# EAGLE design Kapazitätsmessung mit rs232 (EAGLE 4.15)
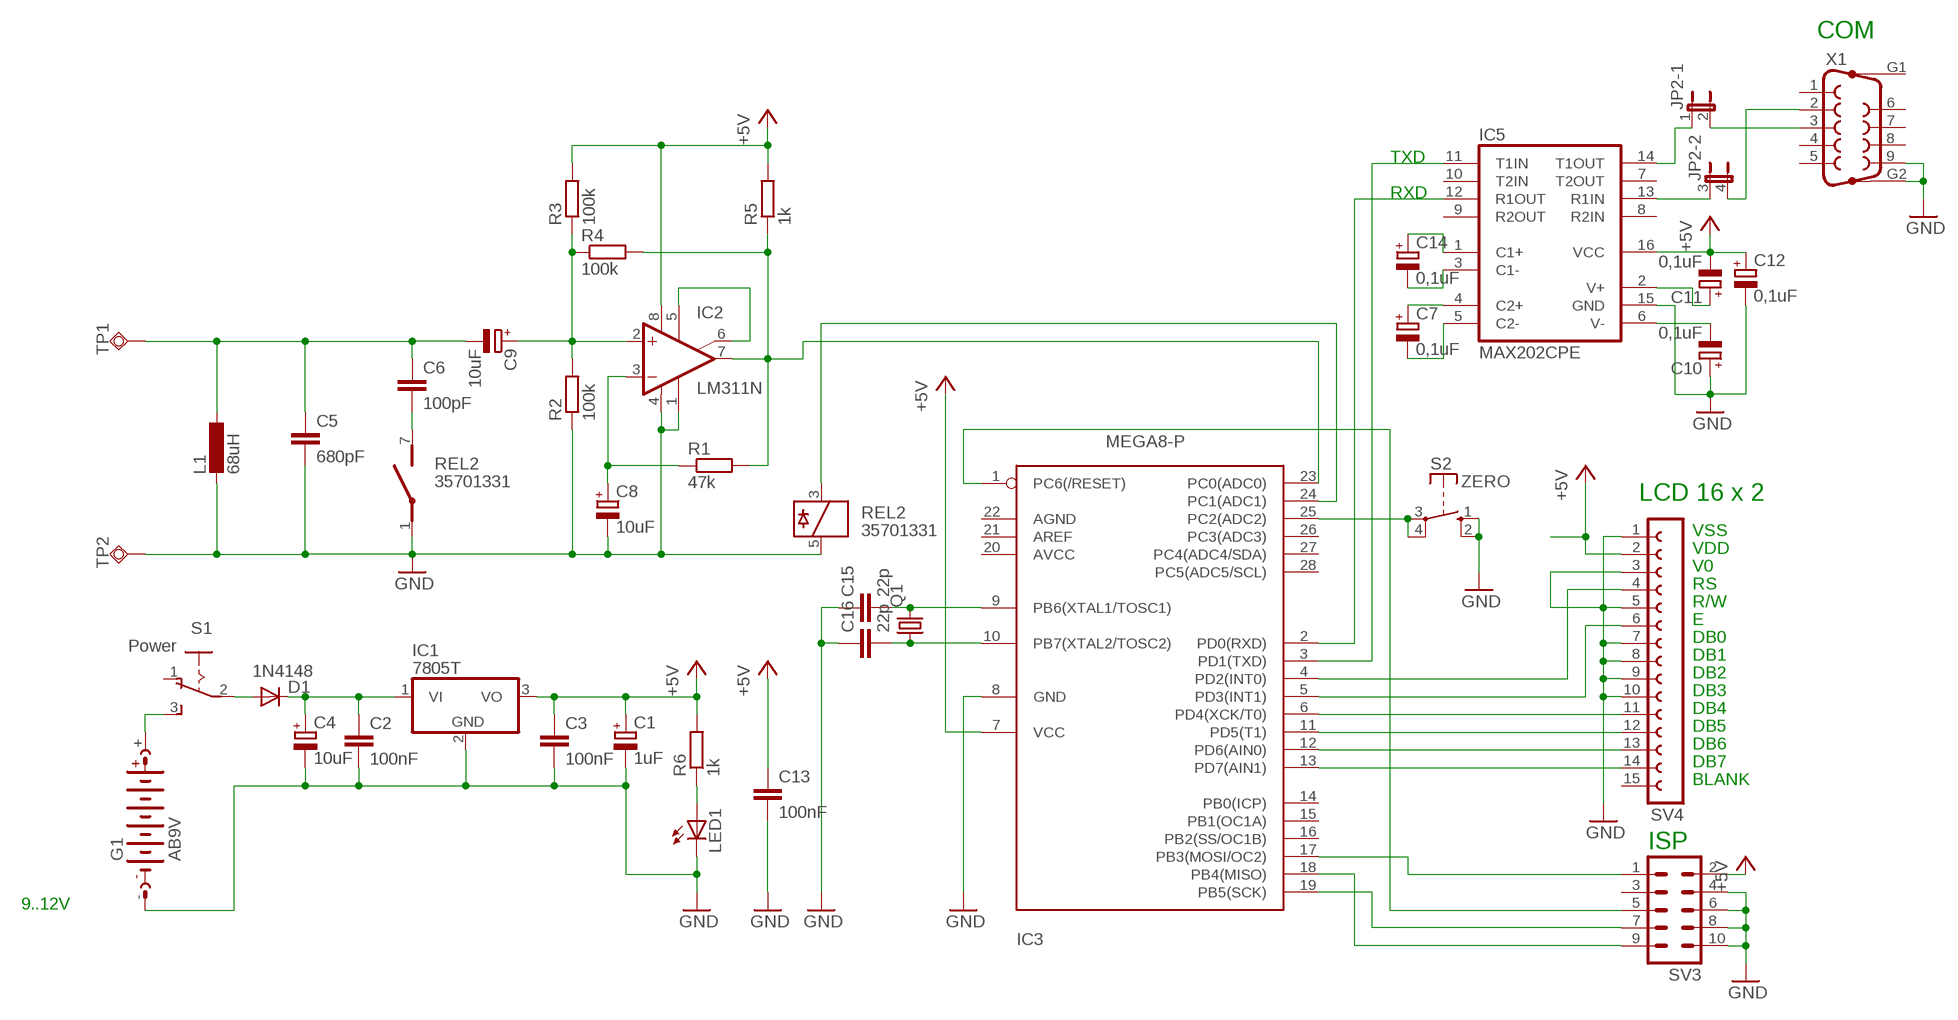
[diagram p0: schematic, sheet 1]

## Parts
C1  1uF  CPOL-EUE2.5-7  [E2,5-7]
C2  100nF  C-EU025-030X050  [C025-030X050]
C3  100nF  C-EU025-030X050  [C025-030X050]
C4  10uF  CPOL-EUE2.5-7  [E2,5-7]
C5  680pF  C-EU025-030X050  [C025-030X050]
C6  100pF  C-EU025-030X050  [C025-030X050]
C7  0,1uF  CPOL-EUE2.5-4V  [E2,5RE]
C8  10uF  CPOL-EUE2.5-5  [E2,5-5]
C9  10uF  CPOL-EUE2.5-5  [E2,5-5]
C10  0,1uF  CPOL-EUE2.5-4V  [E2,5RE]
C11  0,1uF  CPOL-EUE2.5-4V  [E2,5RE]
C12  0,1uF  CPOL-EUE2.5-4V  [E2,5RE]
C13  100nF  C-EU025-030X050  [C025-030X050]
C14  0,1uF  CPOL-EUE2.5-4V  [E2,5RE]
C15  22p  C-EU025-024X044  [C025-024X044]
C16  22p  C-EU025-024X044  [C025-024X044]
D1  1N4148  [DO35-10]
G1  AB9V  [AB9V]
IC1  7805T  [TO220H]
IC2  LM311N  [DIL08]
IC3  MEGA8-P  [DIL28-3]
IC5  MAX202CPE  [DIL16]
JP2  JP2QE  [JP2Q]
L1  68uH  L-EU0207/10  [0207/10]
LED1  LED3MM  [LED3MM]
Q1  CRYTALHC18U-V  [HC18U-V]
R1  47k  R-EU_0207/7  [0207/7]
R2  100k  R-EU_0207/7  [0207/7]
R3  100k  R-EU_0207/7  [0207/7]
R4  100k  R-EU_0207/7  [0207/7]
R5  1k  R-EU_0207/7  [0207/7]
R6  1k  R-EU_0207/7  [0207/7]
REL2  35701331  [REED]
S1  Power  255SB  [255SB]
S2  ZERO  DT6  [DT6]
SV3  ML10  [ML10]
SV4  FE15-1  [FE15]
TP1  TPSQPAD1-20Y  [P1-20Y]
TP2  TPSQPAD1-20Y  [P1-20Y]
X1  F09HP  [F09HP]

## Nets
+5V: C1.+ C3.1 C11.- C12.+ C13.1 IC1.3(VO) IC2.8(V+) IC3.7(VCC) IC5.16(VCC) R3.2 R5.2 R6.2 SV3.2 SV4.2
GND: C1.- C2.2 C3.2 C4.- C5.2 C8.- C10.+ C12.- C13.2 C15.1 C16.1 G1.- IC1.2(GND) IC2.1(GND) IC2.4(V-) IC3.8(GND) IC5.15(GND) L1.2 LED1.K(C) R2.1 REL2.1(2:P) REL2.5 S2.1(S) S2.2(S) SV3.4 SV3.6 SV3.8 SV3.10 SV4.1 SV4.3 SV4.5 SV4.7 SV4.8 SV4.9 SV4.10 TP2.1(TP) X1.9 X1.G2
N$1: D1.A S1.2(P)
N$2: C2.1 C4.+ D1.C IC1.1(VI)
N$3: G1.+ S1.3(S)
N$4: IC3.1(PC6(/RESET)) SV3.5
N$5: IC2.5(ON) IC2.6(ON/STR)
N$6: IC2.7(OUT) IC3.23(PC0(ADC0)) R1.2 R4.2 R5.1
N$7: C14.- IC5.3(C1-)
N$8: C8.+ IC2.3(-IN) R1.1
N$9: C6.2 REL2.7(2:S)
N$10: C9.+ IC2.2(+IN) R2.2 R3.1 R4.1
N$11: C5.1 C6.1 C9.- L1.1 TP1.1(TP)
N$12: C14.+ IC5.1(C1+)
N$13: LED1.A R6.1
N$14: IC3.19(PB5(SCK)) SV3.7
N$15: IC3.18(PB4(MISO)) SV3.9
N$16: IC5.14(T1OUT) JP2.1
N$17: JP2.4 X1.2
N$19: C7.+ IC5.4(C2+)
N$20: C7.- IC5.5(C2-)
N$21: IC5.13(R1IN) JP2.3
N$22: C15.2 IC3.9(PB6(XTAL1/TOSC1)) Q1.2
N$23: C16.2 IC3.10(PB7(XTAL2/TOSC2)) Q1.1
N$25: IC3.4(PD2(INT0)) SV4.4
N$26: IC3.5(PD3(INT1)) SV4.6
N$27: IC3.13(PD7(AIN1)) SV4.14
N$28: IC3.12(PD6(AIN0)) SV4.13
N$29: IC3.11(PD5(T1)) SV4.12
N$30: IC3.6(PD4(XCK/T0)) SV4.11
N$31: IC3.17(PB3(MOSI/OC2)) SV3.1
N$33: JP2.2 X1.3
N$34: IC3.24(PC1(ADC1)) REL2.3
N$35: IC3.25(PC2(ADC2)) S2.3(P) S2.4(P)
RXD: IC3.2(PD0(RXD)) IC5.12(R1OUT)
TXD: IC3.3(PD1(TXD)) IC5.11(T1IN)
V+: C11.+ IC5.2(V+)
V-: C10.- IC5.6(V-)
Unconnected: IC3.14(PB0(ICP)) IC3.15(PB1(OC1A)) IC3.16(PB2(SS/OC1B)) IC3.20(AVCC) IC3.21(AREF) IC3.22(AGND) IC3.26(PC3(ADC3)) IC3.27(PC4(ADC4/SDA)) IC3.28(PC5(ADC5/SCL)) IC5.7(T2OUT) IC5.8(R2IN) IC5.9(R2OUT) IC5.10(T2IN) S1.1(O) SV3.3 SV4.15 X1.1 X1.4 X1.5 X1.6 X1.7 X1.8 X1.G1

## Notes on the sheet
- COM
- TXD
- RXD
- LCD 16 x 2
- VSS
- VDD
- V0
- RS
- R/W
- E
- DB0
- DB1
- DB2
- DB3
- DB4
- DB5
- DB6
- DB7
- BLANK
- ISP
- 9..12V

## Library data of the parts
C1 C4 C7-C12 C14 = rcl:CPOL-EU: POLARIZED CAPACITOR, European symbol
C2 C3 C5 C6 C13 C15 C16 = rcl:C-EU: CAPACITOR, European symbol
D1 = diode:1N4148: DIODE high speed (Philips)
G1 = battery:AB9V: 9-V BATTERY CLIP
IC1 = linear:78*: Positive VOLTAGE REGULATOR Source: http://cache.national.com/ds/LM/LM78L05.pdf http://www.fairchildsemi.com/ds/LM/LM7805.pdf
IC2 = linear:LM311: COMPARATOR
IC3 = atmel2:MEGA8-P: MICROCONTROLLER 8 Kbytes FLASH 1 kbytes SRAM 512 bytes EEPROM USART 4-channel 10 bit ADC 2-channel 8 bit ADC
IC5 = maxim:MAX202CPE: RS232 TRANSEIVER
JP2 = jumper:JP2QE: JUMPER
L1 = rcl:L-EU: INDUCTOR, European symbol
LED1 = led:LED: LED OSRAM: - CHIPLED LG R971, LG N971, LY N971, LG Q971, LY Q971, LO R971, LY R971 LH N974, LH R974 LS Q976, LO Q976, LY Q976 LO Q996 - Hyper CHIPLED LW Q18S LB Q993, LB Q99A, LB R99A - SideLED LS A670, LO A670, LY A670, LG A670, LP A670 LB A673, LV A673, LT A673, LW A673 LH A674 LY A675 LS A676, LA A676, LO A676, LY A676, LW A676 LS A679, LY A679, LG A679 - Hyper Micro SIDELED® LS Y876, LA Y876, LO Y876, LY Y876 LT Y87S - SmartLED LW L88C, LW L88S LB L89C, LB L89S, LG L890 LS L89K, LO L89K, LY L89K LS L896, LA L896, LO L896, LY L896 - TOPLED LS T670, LO T670, LY T670, LG T670, LP T670 LSG T670, LSP T670, LSY T670, LOP T670, LYG T670 LG T671, LOG T671, LSG T671 LB T673, LV T673, LT T673, LW T673 LH T674 LS T676, LA T676, LO T676, LY T676, LB T676, LH T676, LSB T676, LW T676 LB T67C, LV T67C, LT T67C, LS T67K, LO T67K, LY T67K, LW E67C LS E67B, LA E67B, LO E67B, LY E67B, LB E67C, LV E67C, LT E67C LW T67C LS T679, LY T679, LG T679 LS T770, LO T770, LY T770, LG T770, LP T770 LB T773, LV T773, LT T773, LW T773 LH T774 LS E675, LA E675, LY E675, LS T675 LS T776, LA T776, LO T776, LY T776, LB T776 LHGB T686 LT T68C, LB T68C - Hyper Mini TOPLED® LB M676 - Mini TOPLED Santana® LG M470 LS M47K, LO M47K, LY M47K Source: http://www.osram.convergy.de/
Q1 = crystal:CRYTAL: CRYSTAL
R1-R6 = rcl:R-EU_: RESISTOR, European symbol
REL2 = relay:35701331: RELAY reed, 1 x norm. open with polarity
S1 = switch:255SB: SLIDING SWITCH distributor Buerklin, 11G810
S2 = switch-misc:DT: ITT SWITCH
SV3 = con-harting-ml:ML10: HARTING
SV4 = con-lsta:FE15-1: FEMALE HEADER
TP1 TP2 = testpad:TPSQ
X1 = con-subd:F09HP: SUB-D

## Board
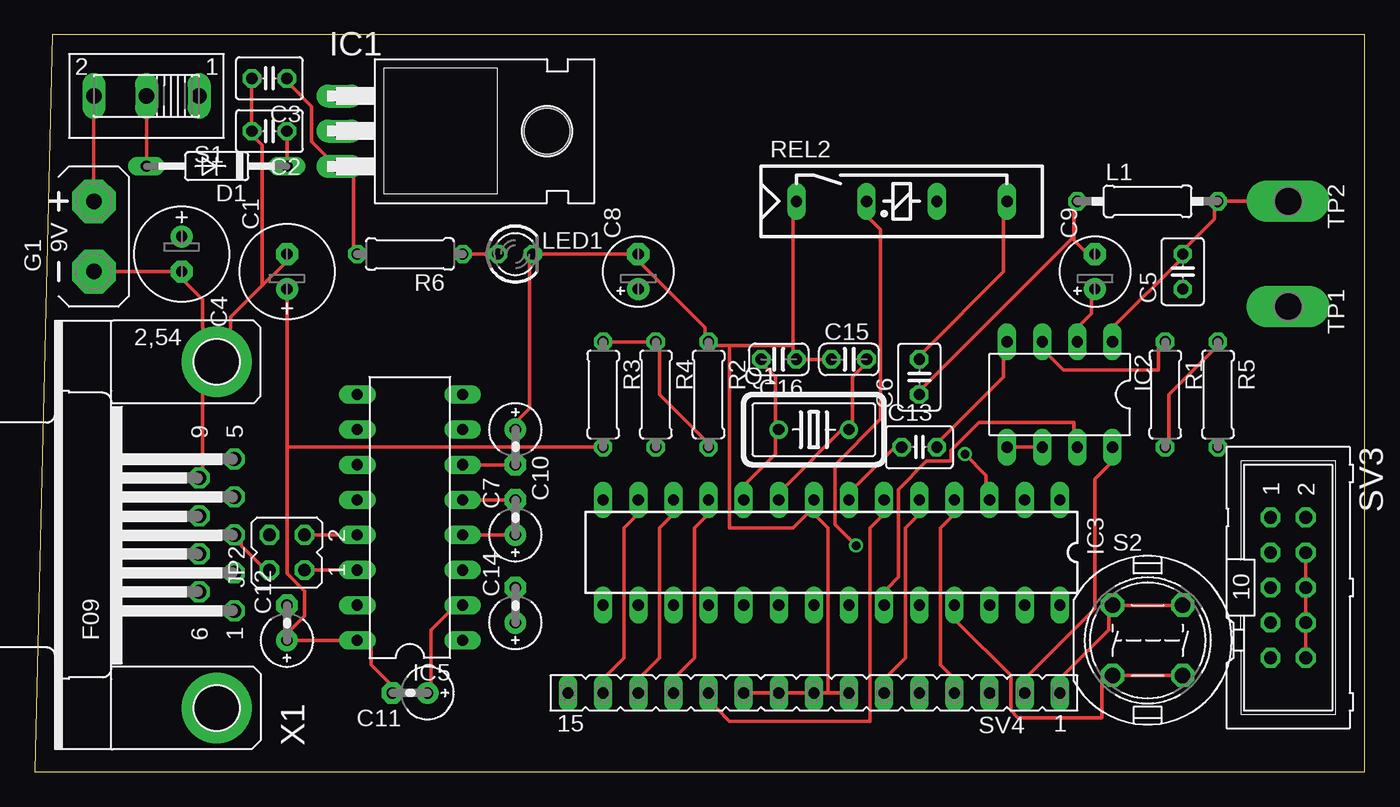
[diagram p1: board, top side]
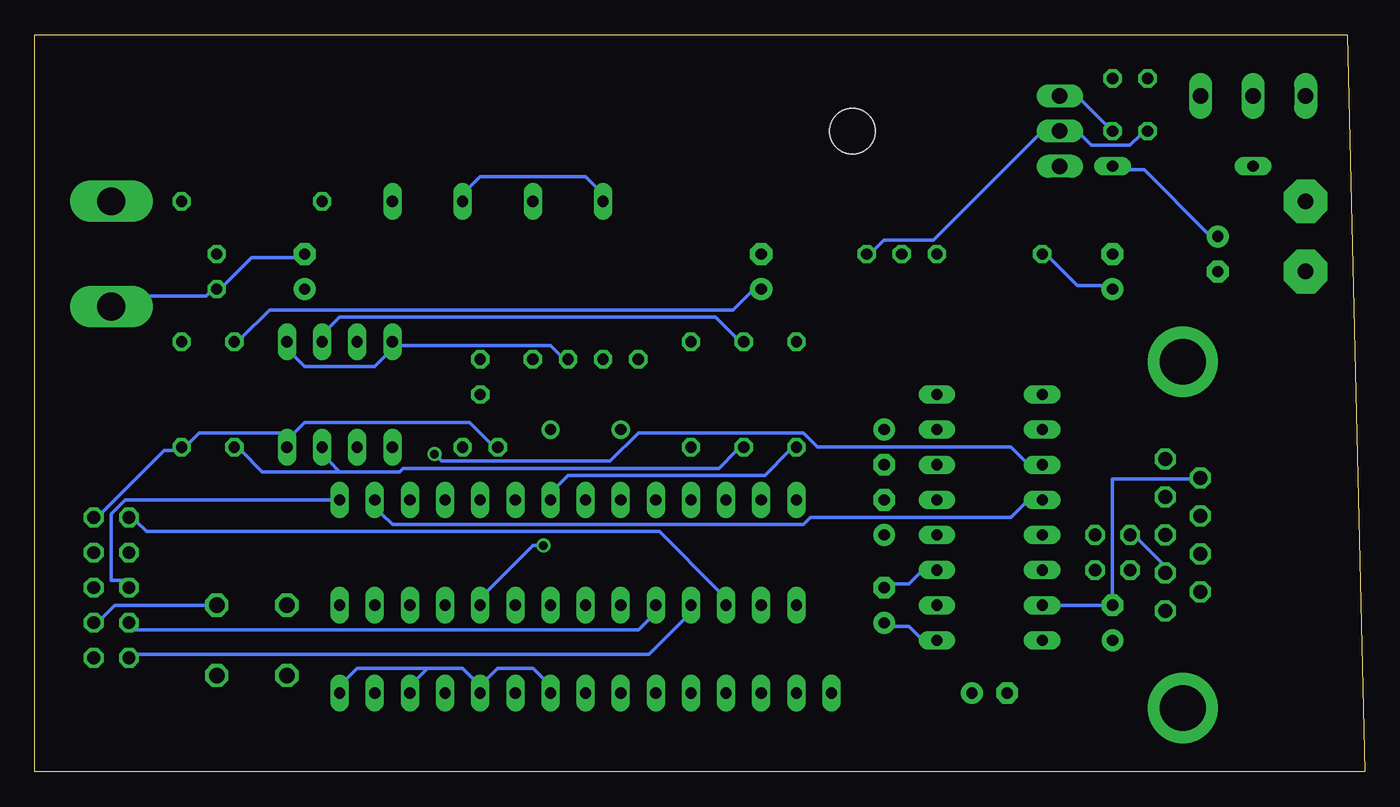
[diagram p2: board, bottom side, seen from below]

Size 96.19 x 53.33 mm. Coordinates in mm from the lower left corner, seen from the top.
Outline: 0,0 96.19,0 96.19,53.33 1.27,53.33 0,0
Copper layers (1*16): Top 0.035mm / dielectric 1.5mm / Bottom 0.035mm
Design rules "default": minimum track width 10mil, minimum drill 24mil, track to track 8mil, track to pad 8mil, pad to pad 8mil, via to via 8mil, smd to smd 8mil, copper to edge 40mil, drill to drill 8mil, minimum pad ring 10mil, minimum via ring 8mil, stop-mask expansion 4mil, vias tented up to drill 0mil, thermal gap 10mil

### Footprints (pad centres in the part's own frame; a part is rotated, then mirrored left to right if it is on the bottom)
E2,5-7 = drill 0.813 pad 1.6 round: + -1.27,0 | drill 0.813 pad 1.6 octagon: - 1.27,0
C025-030X050 = drill 0.813 octagon: 1 -1.27,0; 2 1.27,0
E2,5RE = drill 0.813 pad 1.575 round: + -1.27,0 | drill 0.813 pad 1.575 octagon: - 1.27,0
E2,5-5 = drill 0.813 pad 1.6 round: + -1.27,0 | drill 0.813 pad 1.6 octagon: - 1.27,0
C025-024X044 = drill 0.813 octagon: 1 -1.27,0; 2 1.27,0
DO35-10 = drill 0.813 long: A 5.08,0; C -5.08,0
AB9V = drill 1.118 pad 3.15 octagon: + 0,2.54; - 0,-2.54
TO220H = drill 1.118 long: 1 -2.54,-10.16; 2 0,-10.16; 3 2.54,-10.16 | hole 3.302: 0,4.826
DIL08 = drill 0.813 long: 1 -3.81,-3.81; 2 -1.27,-3.81; 3 1.27,-3.81; 4 3.81,-3.81; 5 3.81,3.81; 6 1.27,3.81; 7 -1.27,3.81; 8 -3.81,3.81
DIL28-3 = drill 0.813 long: 1 -16.51,-3.81; 2 -13.97,-3.81; 3 -11.43,-3.81; 4 -8.89,-3.81; 5 -6.35,-3.81; 6 -3.81,-3.81; 7 -1.27,-3.81; 8 1.27,-3.81; 9 3.81,-3.81; 10 6.35,-3.81; 11 8.89,-3.81; 12 11.43,-3.81; 13 13.97,-3.81; 14 16.51,-3.81; 15 16.51,3.81; 16 13.97,3.81; 17 11.43,3.81; 18 8.89,3.81; 19 6.35,3.81; 20 3.81,3.81; 21 1.27,3.81; 22 -1.27,3.81; 23 -3.81,3.81; 24 -6.35,3.81; 25 -8.89,3.81; 26 -11.43,3.81; 27 -13.97,3.81; 28 -16.51,3.81
DIL16 = drill 0.813 long: 1 -8.89,-3.81; 2 -6.35,-3.81; 3 -3.81,-3.81; 4 -1.27,-3.81; 5 1.27,-3.81; 6 3.81,-3.81; 7 6.35,-3.81; 8 8.89,-3.81; 9 8.89,3.81; 10 6.35,3.81; 11 3.81,3.81; 12 1.27,3.81; 13 -1.27,3.81; 14 -3.81,3.81; 15 -6.35,3.81; 16 -8.89,3.81
JP2Q = drill 0.914 octagon: 1 -1.27,-1.27; 2 -1.27,1.27; 3 1.27,-1.27; 4 1.27,1.27
0207/10 = drill 0.813 octagon: 1 -5.08,0; 2 5.08,0
LED3MM = drill 0.813 octagon: A -1.27,0; K 1.27,0
HC18U-V = drill 0.813 round: 1 -2.54,0; 2 2.54,0
0207/7 = drill 0.813 octagon: 1 -3.81,0; 2 3.81,0
REED = drill 0.813 long: 1 -17.78,2.54; 3 -12.7,2.54; 5 -7.62,2.54; 7 -2.54,2.54
255SB = drill 1.118 long: 1 -3.81,0; 2 0,0; 3 3.81,0
DT6 = drill 1.118 octagon: 1 -2.54,2.54; 2 2.54,2.54; 3 2.54,-2.54; 4 -2.54,-2.54
ML10 = drill 0.914 octagon: 1 -5.08,-1.27; 2 -5.08,1.27; 3 -2.54,-1.27; 4 -2.54,1.27; 5 0,-1.27; 6 0,1.27; 7 2.54,-1.27; 8 2.54,1.27; 9 5.08,-1.27; 10 5.08,1.27
FE15 = drill 0.813 long: 1 -17.78,0; 2 -15.24,0; 3 -12.7,0; 4 -10.16,0; 5 -7.62,0; 6 -5.08,0; 7 -2.54,0; 8 0,0; 9 2.54,0; 10 5.08,0; 11 7.62,0; 12 10.16,0; 13 12.7,0; 14 15.24,0; 15 17.78,0
P1-20Y = drill 2.007 pad 2.54 long: 1 0,0
F09HP = drill 1.016 octagon: 1 -5.486,-1.27; 2 -2.743,-1.27; 3 0,-1.27; 4 2.743,-1.27; 5 5.486,-1.27; 6 -4.115,1.27; 7 -1.372,1.27; 8 1.372,1.27; 9 4.115,1.27 | drill 3.302 pad 5.08 round: G1 -12.522,0; G2 12.522,0

### Placement (x,y rotation side)
C1  18.25,36.19 90 top
C2  16.98,46.35 180 top
C3  16.98,50.16 180 top
C4  10.63,37.46 270 top
C5  83.02,36.19 90 top
C6  63.97,28.57 90 top
C7  34.76,18.41 90 top
C8  43.65,36.19 90 top
C9  76.67,36.19 90 top
C10  34.76,23.49 270 top
C11  27.14,5.71 180 top
C12  18.25,10.79 90 top
C13  63.97,23.49 0 top
C14  34.76,12.06 90 top
C15  58.89,29.84 0 top
C16  53.81,29.84 180 top
D1  13.17,43.81 180 top
G1  4.28,38.73 0 top
IC1  32.22,46.35 270 top
IC2  74.13,27.3 180 top
IC3  57.62,15.87 180 top
IC5  27.14,18.41 90 top
JP2  18.25,15.87 90 top
L1  80.48,41.27 0 top
LED1  34.76,37.46 0 top
Q1  56.35,24.76 0 top
R1  81.75,27.3 270 top
R2  48.73,27.3 270 top
R3  41.11,27.3 270 top
R4  44.92,27.3 270 top
R5  85.56,27.3 270 top
R6  27.14,37.46 180 top
REL2  72.86,38.73 0 top
S1  8.09,48.89 180 top
S2  80.48,9.52 0 top
SV3  90.64,13.33 270 top
SV4  56.35,5.71 180 top
TP1  90.64,33.65 270 top
TP2  90.64,41.27 270 top
X1  13.17,17.14 90 top

### Tracks (layer width: path | path; a pad name or v marks a point on that pad's centre or on a via)
+5V
  Top 0.254: C11.- 25.62,6.47 24.35,7.74 24.35,9.01 IC5.16 C12.+ 18.5,10.28 19.52,11.3 19.52,13.08 18.25,14.35 18.25,23.49 | C3.1 18.5,49.65 20.03,48.13 20.03,45.59 21.04,44.57 IC1.3 23.08,43.05 23.08,37.97 R6.2 | 18.25,23.49 C1.+ | IC3.7 59.4,20.7 62.19,23.49 C13.1 | SV4.2 71.84,6.98 76.67,11.81 76.67,21.2 77.69,22.22 IC2.8 | 18.25,23.49 R3.2
  Bottom 0.254: R6.2 22.82,37.21 20.79,35.17 19.01,35.17 C1.+ | R3.2 41.62,23.24 43.4,21.46 57.62,21.46 58.38,20.7 IC3.7 | SV3.2 91.4,18.66 86.83,23.24 86.07,23.24 R5.2 85.05,23.74 84.29,24.51 78.45,24.51 IC2.8 77.43,24.51 76.67,25.27 64.73,25.27 63.21,23.74 C13.1
GND
  Top 0.254: C3.2 C2.2 15.96,45.84 16.47,45.33 16.47,35.17 | X1.9 12.15,21.97 12.15,27.3 X1.G2 | X1.G2 12.15,32.13 12.15,34.16 10.88,35.43 C4.- G1.- | 16.47,35.17 14.19,32.89 14.19,32.13 X1.G2 | 16.47,35.17 18,36.7 C1.- | SV3.10 SV3.8 SV3.6 SV3.4 | SV4.1 74.38,6.98 77.69,10.28 77.69,11.3 S2.1 S2.2 | SV4.10 SV4.9 SV4.8 57.37,5.71 | 57.37,5.71 SV4.7 | 57.37,5.71 57.37,17.65 56.6,18.41 IC3.8 55.84,18.66 54.83,17.65 50.25,17.65 50.25,30.86 | C10.+ 35.01,25.52 35.78,26.28 35.78,36.95 LED1.K C8.- 43.9,36.7 48.48,32.13 48.48,31.62 R2.1 49.24,30.86 50.25,30.86 | C15.1 C16.1 54.83,30.35 54.83,30.86 | 50.25,30.86 54.83,30.86 | 54.83,30.86 54.83,40 REL2.1 | C13.2 65.49,24 70.07,28.57 70.07,29.84 IC2.4 | IC2.1 78.19,32.38 82.77,36.95 C5.2 83.27,37.97 85.31,40 85.31,40.76 L1.2 TP2.1
  Bottom 0.254: C2.2 16.22,46.1 16.98,45.33 19.77,45.33 20.54,46.1 IC1.2 23.58,46.1 31.2,38.48 34.76,38.48 35.52,37.71 LED1.K | IC5.15 C12.- 18.25,21.2 12.41,21.2 X1.9 | SV3.8 91.4,11.04 90.39,12.06 S2.2 | 67.78,7.49 65.24,7.49 64.48,6.73 SV4.5 63.46,6.73 62.7,7.49 60.16,7.49 59.4,6.73 SV4.7 | 67.78,7.49 68.54,6.73 SV4.3 | 67.78,7.49 72.86,7.49 73.62,6.73 SV4.1 | REL2.5 64.73,42.29 63.97,43.05 56.35,43.05 55.59,42.29 REL2.1 | IC2.1 77.43,30.09 76.67,29.33 71.59,29.33 70.83,30.09 IC2.4 69.81,30.86 58.89,30.86 58.13,30.09 C15.1
N$1
  Top 0.254: D1.A S1.2
N$2
  Top 0.254: D1.C C2.1
  Bottom 0.254: C4.+ 11.39,38.98 15.96,43.56 16.98,43.56 D1.C | IC1.1 20.54,48.64 18.76,46.86 18.5,46.86 C2.1
N$3
  Top 0.254: G1.+ S1.3
N$4
  Bottom 0.254: IC3.1 89.62,19.68 90.64,18.66 90.64,13.84 89.62,13.84 SV3.5
N$5
  Top 0.254: IC2.5 IC2.6
N$6
  Top 0.254: IC3.23 61.68,13.33 62.45,14.09 62.45,20.44 64.48,22.47 66.26,22.47 66.26,23.24 68.29,25.27 75.15,25.27 75.15,24.76 IC2.7 | R5.1 85.31,30.6 82,27.3 82,24 R1.2
  Bottom 0.254: 74.13,21.71 69.81,21.71 69.56,21.97 46.7,21.97 45.43,23.24 R4.2 | 74.13,21.71 74.89,22.47 IC2.7 | 74.13,21.71 79.72,21.71 81.24,23.24 R1.2
N$7
  Bottom 0.254: IC5.3 32.22,14.35 32.98,13.58 34,13.58 C14.-
N$8
  Top 0.254: IC2.3 73.37,30.09 74.38,29.08 81.24,29.08 81.24,30.86 R1.1
  Bottom 0.254: C8.+ 44.41,34.67 45.68,33.4 79.21,33.4 81.24,31.36 R1.1
N$9
  Top 0.254: C6.2 64.22,30.35 70.07,36.19 70.07,40 REL2.7
N$10
  Top 0.254: IC2.2 75.65,32.38 76.42,33.14 76.42,34.16 C9.+ | R3.1 R4.1 45.17,30.6 45.17,27.3 48.48,24 R2.2
  Bottom 0.254: IC2.2 74.89,32.13 74.13,32.89 46.95,32.89 45.43,31.36 R4.1
N$11
  Top 0.254: 75.15,38.73 64.22,27.81 C6.1 | 75.15,38.73 75.15,40.76 L1.1 | 75.15,38.73 75.15,38.48 75.91,37.71 C9.-
  Bottom 0.254: TP1.1 87.85,34.41 83.78,34.41 83.53,34.67 C5.1 82.51,35.17 80.48,37.21 77.43,37.21 C9.-
N$12
  Bottom 0.254: IC5.1 32.22,9.77 32.98,10.54 34,10.54 C14.+
N$13
  Top 0.254: R6.1 LED1.A
N$14
  Bottom 0.254: IC3.19 51.78,11.04 52.54,10.28 89.12,10.28 SV3.7
N$15
  Bottom 0.254: IC3.18 49.24,11.04 51.78,8.5 88.86,8.5 SV3.9
N$16
  Top 0.254: JP2.1 IC5.14
N$17
  Bottom 0.254: JP2.4 16.47,16.89 14.69,15.11 X1.2
N$19
  Top 0.254: IC5.4 C7.+
N$20
  Top 0.254: IC5.5 C7.-
N$21
  Top 0.254: JP2.3 IC5.13
N$22
  Top 0.254: IC3.9 54.32,20.7 58.38,24.76 Q1.2 59.14,25.27 59.14,28.57 59.91,29.33 C15.2
N$23
  Top 0.254: IC3.10 51.52,20.95 53.56,22.98 53.56,24.25 Q1.1 53.56,25.27 53.56,28.57 52.79,29.33 C16.2
N$25
  Top 0.254: SV4.4 66.26,6.98 65.49,7.74 65.49,17.65 66.26,18.41 IC3.4
N$26
  Top 0.254: SV4.6 61.68,6.98 62.95,8.25 62.95,17.65 63.72,18.41 IC3.5
N$27
  Top 0.254: SV4.14 41.36,6.98 42.63,8.25 42.63,17.65 43.4,18.41 IC3.13
N$28
  Top 0.254: SV4.13 43.9,6.98 45.17,8.25 45.17,17.65 45.94,18.41 IC3.12
N$29
  Top 0.254: SV4.12 46.44,6.98 47.71,8.25 47.71,17.65 48.48,18.41 IC3.11
N$30
  Top 0.254: SV4.11 49.24,4.69 50.25,3.68 60.41,3.68 60.41,17.65 61.18,18.41 IC3.6
N$31
  Bottom 0.254: IC3.17 46.7,13.08 51.02,17.39 88.1,17.39 88.86,18.16 SV3.1
N$33
  Top 0.254: JP2.2 16.47,14.85 14.95,16.38 14.95,16.63 X1.3
N$34  (via drill 0.61)
  Top 0.254: v59.4,16.38 57.87,17.9 57.87,22.22 61.18,25.52 61.18,39.24 60.41,40 REL2.3
  Bottom 0.254: v59.4,16.38 60.16,16.38 63.46,13.08 IC3.24
N$35
  Top 0.254: IC3.25 66.76,10.79 70.57,6.98 70.57,4.44 71.08,3.93 77.18,3.93 77.18,6.73 S2.4 S2.3
RXD
  Bottom 0.254: IC5.12 24.6,19.43 25.62,18.41 40.09,18.41 40.6,17.9 70.32,17.9 71.08,18.66 IC3.2
TXD  (via drill 0.61)
  Top 0.254: v67.27,22.98 68.8,21.46 68.8,20.95 IC3.3
  Bottom 0.254: v67.27,22.98 66.76,22.47 54.57,22.47 52.54,24.51 40.6,24.51 39.59,23.49 25.62,23.49 24.6,22.47 IC5.11
V+
  Top 0.254: IC5.2 29.93,11.55 28.66,10.28 28.66,6.47 C11.+
V-
  Top 0.254: IC5.6 C10.-